# Altium schematic sheet Sheet1.SchDoc
size A4; SheetNumber: 1; SheetTotal: 7
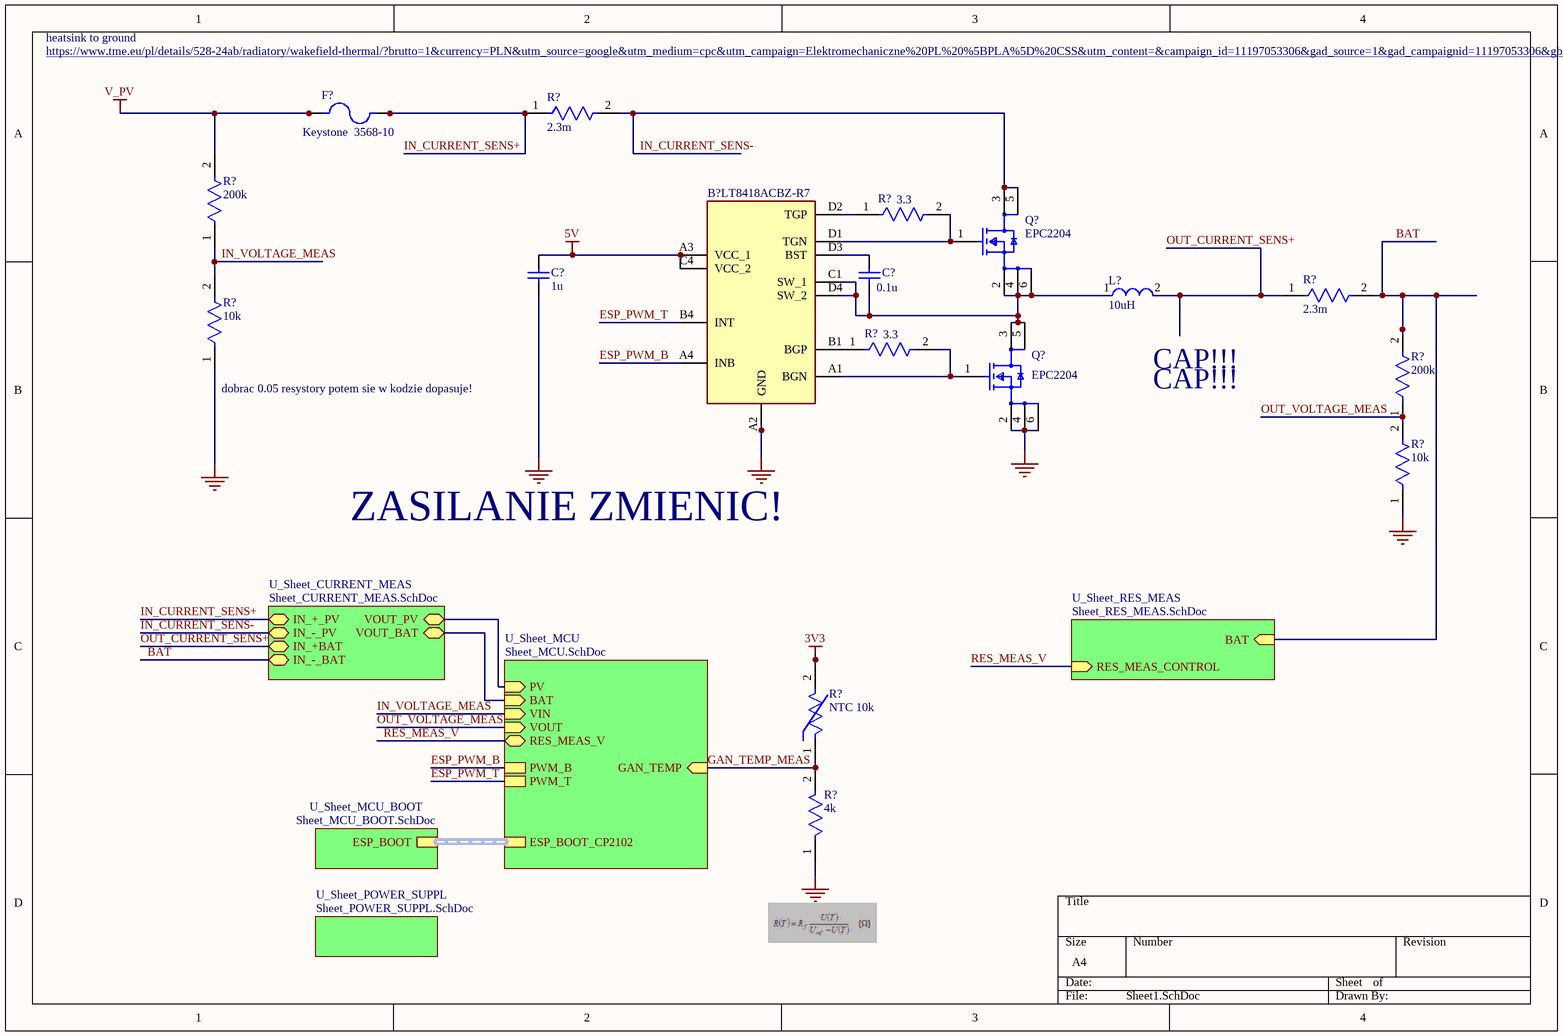
[diagram p0: Sheet1.SchDoc]

## Parts
(Parts that share a designator on the sheet are numbered #1, #2 ... from top to bottom, then left to right.)
B?  LT8418ACBZ-R7  [BGA12C40P4X4_167X167X56]
C?#1  1u  [CAPC2013X140X50LL20T25]
C?#2  0.1u  [CAPC2013X140X45LL15T25]
F?  Keystone  3568-10  [FUSE_3568-10]
L?  10uH  [FP-IHLP-5050EZ-FP_3_226x4-MFG]
Q?#1  EPC2204  [FP-EPC2204-MFG]
Q?#2  EPC2204  [FP-EPC2204-MFG]
R?#1  2.3m  [FP-WSLF2512-1_02-MFG]
R?#2  3.3  [FP-ESR10-IPC_A]
R?#3  200k  [FP-RT0805-MFG]
R?#4  2.3m  [FP-WSLF2512-1_02-MFG]
R?#5  3.3  [FP-ESR10-IPC_A]
R?#6  10k  [FP-RT0805-MFG]
R?#7  200k  [FP-RT0805-MFG]
R?#8  10k  [FP-RT0805-MFG]
R?#9  NTC 10k  [FP-NCP21-0_2-IPC_C]
R?#10  4k  [FP-RN732A-MFG]

## Sub-sheets
U_Sheet_CURRENT_MEAS = Sheet_CURRENT_MEAS.SchDoc: IN_+_PV (bidir), IN_-_PV (bidir), IN_+BAT (bidir), IN_-_BAT (bidir), VOUT_PV (bidir), VOUT_BAT (bidir)
U_Sheet_MCU = Sheet_MCU.SchDoc: ESP_BOOT_CP2102 (harness ESP_BOOT_CP2102), PV (in), VIN (in), VOUT (in), BAT (in), RES_MEAS_V (bidir), PWM_B, PWM_T, GAN_TEMP (in)
U_Sheet_MCU_BOOT = Sheet_MCU_BOOT.SchDoc: ESP_BOOT (harness ESP_BOOT_CP2102)
U_Sheet_POWER_SUPPL = Sheet_POWER_SUPPL.SchDoc: no entries
U_Sheet_RES_MEAS = Sheet_RES_MEAS.SchDoc: RES_MEAS_CONTROL (in), BAT (in)

## Nets
3V3: R?#9.2
5V: B?.A3(VCC_1) B?.C4(VCC_2) C?#1.2
GND: B?.A2(GND) C?#1.1 Q?#2.2(Source) Q?#2.4(Source) Q?#2.6(Source) R?#6.1 R?#8.1 R?#10.1
V_PV: F?.1 F?.3 R?#3.2
BAT: R?#4.2 R?#7.2 ; sheet U_Sheet_CURRENT_MEAS/IN_-_BAT, sheet U_Sheet_RES_MEAS/BAT
ESP_PWM_B: B?.A4(INB) ; sheet U_Sheet_MCU/PWM_B
ESP_PWM_T: B?.B4(INT) ; sheet U_Sheet_MCU/PWM_T
GAN_TEMP_MEAS: R?#9.1 R?#10.2 ; sheet U_Sheet_MCU/GAN_TEMP
IN_CURRENT_SENS+: F?.2 F?.4 R?#1.1 ; sheet U_Sheet_CURRENT_MEAS/IN_+_PV
IN_CURRENT_SENS-: Q?#1.3(Drain) Q?#1.5(Drain) R?#1.2 ; sheet U_Sheet_CURRENT_MEAS/IN_-_PV
IN_VOLTAGE_MEAS: R?#3.1 R?#6.2 ; sheet U_Sheet_MCU/VIN
OUT_CURRENT_SENS+: L?.2 R?#4.1 ; sheet U_Sheet_CURRENT_MEAS/IN_+BAT
OUT_VOLTAGE_MEAS: R?#7.1 R?#8.2 ; sheet U_Sheet_MCU/VOUT
RES_MEAS_V: sheet U_Sheet_MCU/RES_MEAS_V, sheet U_Sheet_RES_MEAS/RES_MEAS_CONTROL
NetB?_A1: B?.A1(BGN) Q?#2.1(Gate) R?#5.2
NetB?_B1: B?.B1(BGP) R?#5.1
NetB?_C1: B?.C1(SW_1) B?.D4(SW_2) C?#2.1 L?.1 Q?#1.2(Source) Q?#1.4(Source) Q?#1.6(Source) Q?#2.3(Drain) Q?#2.5(Drain)
NetB?_D1: B?.D1(TGN) Q?#1.1(Gate) R?#2.2
NetB?_D2: B?.D2(TGP) R?#2.1
NetB?_D3: B?.D3(BST) C?#2.2
(unnamed): sheet U_Sheet_MCU/PV, sheet U_Sheet_CURRENT_MEAS/VOUT_PV
(unnamed): sheet U_Sheet_MCU/BAT, sheet U_Sheet_CURRENT_MEAS/VOUT_BAT

## Buses and harness runs
harness sheet U_Sheet_MCU/ESP_BOOT_CP2102 = sheet U_Sheet_MCU_BOOT/ESP_BOOT

## Notes on the sheet
- heatsink to ground
- https://www.tme.eu/pl/details/528-24ab/radiatory/wakefield-thermal/?brutto=1&currency=PLN&utm_source=google&utm_medium=cpc&utm_campaign=Elektromechaniczne%20PL%20%5BPLA%5D%20CSS&utm_content=&campaign_id=11197053306&gad_source=1&gad_campaignid=11197053306&gbraid=0AAAAADyylhLZbvY-cskZoRzBLKTwpPTA7&gclid=Cj0KCQiA2bTNBhDjARIsAK89wlHUc6paiocvVZBOlYyiqLQ5ZEe9kHkqtYY_EUCSDrDoMr3ZsjBrI2saAg7CEALw_wcB
- (near L?) CAP!!!
- (near R?#6) dobrac 0.05 resystory potem sie w kodzie dopasuje!
- CAP!!!
- ZASILANIE ZMIENIC!

## Library data of the parts
B? = LT8418ACBZ-R7: 100V Half-Bridge GaN Driver with Smart Integrated Bootstrap Switch; Manufacturer_Name: Analog Devices; Geometry.Height: 0.56mm; Manufacturer_Part_Number: LT8418ACBZ-R7; Mouser Part Number: 584-LT8418ACBZ-R7; Mouser Price/Stock: https://www.mouser.co.uk/ProductDetail/Analog-Devices/LT8418ACBZ-R7?qs=mELouGlnn3eZ%252BVjhQJercg%3D%3D; Arrow Part Number: LT8418ACBZ-R7; Arrow Price/Stock: https://www.arrow.com/en/products/lt8418acbz-r7/analog-devices?utm_currency=USD&region=nac; Datasheet Link: https://www.analog.com/LT8418/datasheet
C?#1 = CMP-1036-04749-2: Manufacturer: Kemet; Part Number: C0805C105M4RACTU
C?#2 = CMP-2007-03344-1: Part Number: GCM21BR71E104KA37L; Manufacturer: Murata
F? = 3568-10: Holder,THM-Vertical Entry,Mini Automotive Fuse Holder,30 Amps,1 Fuse,Red | Keystone Electronics 3568-10; SnapEDA_Link: https://www.snapeda.com/parts/3568-10/Keystone/view-part/?ref=snap; Package: None; Value: *; MF: Keystone; MP: 3568-10; Check_prices: https://www.snapeda.com/parts/3568-10/Keystone/view-part/?ref=eda
L? = CMP-02424-000353-1: Commercial Inductors, High Saturation Series 10uH 9A 25.5mΩ 20%; Self Resonant Frequency: 5MHz; DC Resistance (DCR): 25.5mR; Max DC Current: 16A; Core Material: Metal; Shielding: Shielded; Test Frequency: 100kHz; Height: 5mm; Width: 12.9mm; Current Rating: 9A; Number of Pins: 2; Inductance Tolerance: 20%; Min Operating Temperature: -55°C; RMS Current (Irms): 9A; Radiation Hardening: No; Height - Seated (Max): 0.197inch; Length: 13.2mm; Saturation Current: 16A; Case/Package: 5050; Termination: SMD/SMT; Inductance: 10uH; Package Quantity: 250; Mount: Surface Mount; Packaging: Tape and Reel; Lead Free: Lead Free; Military Standard: Not; Tolerance: 20%; Depth: 12.9mm; Max Operating Temperature: 125°C
Q?#1 Q?#2 = CMP-166566-000012-1: TRANS GAN 100V DIE 5.6MOHM; RoHS Compliant: Yes
R?#1 R?#4 = CMP-00030-75451314-1: WSLF2512L3000FEA Res Metal Strip 2512 0.0003 Ohm 1% 6W ±200ppm/C Sulfur Resistant Pad SMD Automotive T/R; Power Rating: 10W; Resistance: 300µΩ; Temperature Coefficient: 200ppm/°C; Length: 6.35mm; Case/Package: 2512; NexarPartId: 75451314; Case Code (Imperial): 2512; RoHS: Compliant; Packaging: Cut Tape; Width: 3.175mm; Max Power Dissipation: 6W; Features: Moisture Resistant; Min Operating Temperature: -65°C; Schedule B: 8533210045, 8533210045; Max Operating Temperature: 170°C; Lead Free: Lead Free; Case Code (Metric): 6432; Composition: Metal Element; Number of Terminations: 2; Height: 609.6µm; Tolerance: 1%
R?#2 R?#5 = CMP-08839-000011-1: RES SMD 3.3 OHM 5% 0.4W 0805; Temperature Coefficient: 200ppm/°C; Max Power Dissipation: 400mW; Resistance: 3.3R; Lead Free: Lead Free; Number of Terminations: 2; Case Code (Imperial): 0805; Width: 0.049inch; Tolerance: 5%; Height: 0.026inch; Features: Automotive AEC-Q200; Package Quantity: 1; Case/Package: 0805; Min Operating Temperature: -55°C; Case Code (Metric): 2012; Composition: Thick Film; Length: 0.079inch; Max Operating Temperature: 155°C; Packaging: Tape and Reel
R?#3 R?#7 = CMP-2001-01542-2: RES 200K OHM 1/8W .1% SMD 0805; Manufacturer Part Number: RT0805BRE07200KL; Manufacturer: Yageo; Temperature Coefficient: 50 ppm/°C; Power Rating: 0.125W; Value: 200KΩ; Voltage Rating: 150V; Tolerance: 0.0025; Package: RT0805; Height: 0.6mm; Lead Free: Yes; Digikey Description: RES 200K OHM 1/8W .1% SMD 0805; Footprint Url: http://www.yageo.com/exep/pages/download/literatures/PYu-R_Mount_10.pdf; Temperature Range High: +155°C; ComponentLink2URL: http://www.yageo.com/documents/recent/PYu-RT_1-to-0.01_RoHS_L_9.pdf; Category: Res; ComponentLink2Description: Datasheet; Series: RT; Resistance: 200KΩ; Device Class L3: Chip SMD Resistors; Device Class L1: Passive Components; Composition: Thin Film; Ipc Land Pattern Name: RESC200125X50; Automotive: No; RoHS: TRUE; Octopart: https://octopart.com/rt0805bre07200kl-yageo-1220506; Temperature Range Low: -55°C; Temperature: -55°C to +155°C; Device Class L2: Resistors
R?#6 R?#8 = CMP-03412-013123-1: RES SMD 10K OHM 0.25% 1/8W 0805; Manufacturer Part Number: RT0805CRD0710KL; Manufacturer: Yageo; Value: 10KΩ; Voltage Rating: 150V; Tolerance: 0.005; Power Rating: 0.125W; Temperature Coefficient: 25 ppm/°C; Composition: Thin Film; Device Class L3: Chip SMD Resistors; Automotive: No; ComponentLink2Description: Datasheet; RoHS: TRUE; Temperature Range Low: -55°C; Footprint Url: http://www.yageo.com/exep/pages/download/literatures/PYu-R_Mount_10.pdf; Temperature Range High: +155°C; Digikey Description: RES SMD 10K OHM 0.25% 1/8W 0805; ComponentLink2URL: http://www.yageo.com/documents/recent/PYu-RT_1-to-0.01_RoHS_L_9.pdf; Octopart: https://octopart.com/rt0805crd0710kl-yageo-1253059; Device Class L2: Resistors; Lead Free: Yes; Height: 0.6mm; Temperature: -55°C to +155°C; Resistance: 10KΩ; Series: RT; Ipc Land Pattern Name: RESC200125X50; Category: Res; Device Class L1: Passive Components; Package: RT0805
R?#9 = CMP-2000-06827-2: THERMISTOR NTC 10KOHM 3900K 0805; Accuracy: 3%; Current Rating: 440uA; Power Rating: 200mW; Resistance: 10kR; Tolerance: 5%; Number of Pins: 2; Termination: SMD/SMT; Lead Free: Lead Free; Radiation Hardening: No; Mount: Surface Mount; Case Code (Metric): 2012; Depth: 1.25mm; Max Operating Temperature: 125°C; Height: 0.85mm; Case Code (Imperial): 0805; Package Quantity: 4000; Length: 2mm; Case/Package: 0805; Min Operating Temperature: -40°C; Packaging: Tape and Reel; Max Power Dissipation: 200mW; Thickness: 150um; REACH SVHC: No SVHC
R?#10 = CMP-03211-001183-1: SMD Chip Resistor, Thin Film, 22.1KΩ, 100 V, 0805 [2012 Metric], 100 mW, 0.1%, RN73 Series; Manufacturer Part Number: RN73C2A22K1BTDF; Manufacturer: TE Connectivity; Power Rating: 0.1W; Temperature Coefficient: 10ppm/°C; Voltage Rating: 100V; Package: RN732A; Lead Free: Yes; ComponentLink2URL: https://www.te.com/commerce/DocumentDelivery/DDEController?Action=showdoc&DocId=Data+Sheet%7F1773270%7FP%7Fpdf%7FEnglish%7FENG_DS_1773270_P.pdf%7F1676162-2; Temperature Range High: 155°C; Series: RN73; packaging: 1000 Reel; RoHS: TRUE; Automotive: No; Composition: Thin Film; Resistance: 22.1KΩ; Ipc Land Pattern Name: RESC200125X55; Category: Res; octopart_url: https://octopart.com/rn73c2a22k1btdf-te+connectivity-41129296; Device Class L2: Resistors; Device Class L3: Chip SMD Resistors; Value: 22.1KΩ; Device Class L1: Passive Components; Height: 0.65mm; Temperature Range Low: -55°C; ComponentLink2Description: Datasheet; Octopart: https://octopart.com/rn73c2a22k1btdf-te+connectivity-41129296; Tolerance: 0.1%; Temperature: -55°C to 155°C